# EAGLE design 16*VibrationdriverMod (EAGLE 7.2.0)
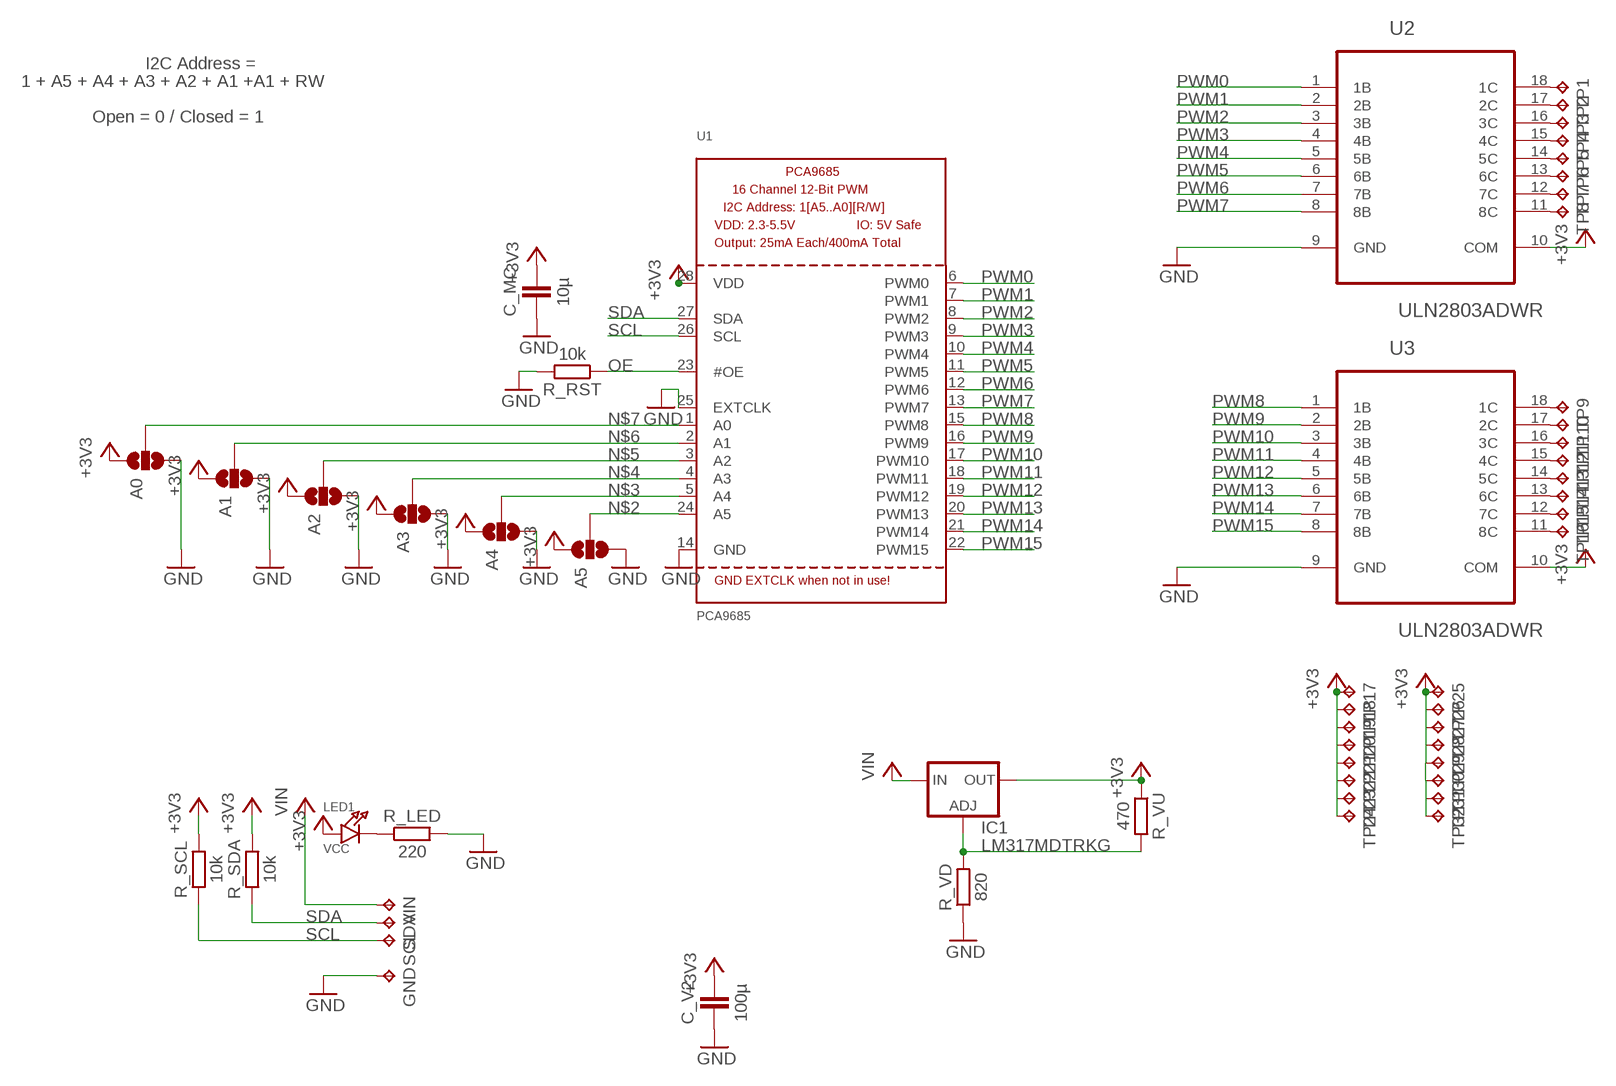
[diagram p0: schematic, sheet 1]

## Parts
A0  SOLDERJUMPER_2WAYPASTE2&3  [SJ_3_PASTE2&3]
A1  SOLDERJUMPER_2WAYPASTE2&3  [SJ_3_PASTE2&3]
A2  SOLDERJUMPER_2WAYPASTE2&3  [SJ_3_PASTE2&3]
A3  SOLDERJUMPER_2WAYPASTE2&3  [SJ_3_PASTE2&3]
A4  SOLDERJUMPER_2WAYPASTE2&3  [SJ_3_PASTE2&3]
A5  SOLDERJUMPER_2WAYPASTE2&3  [SJ_3_PASTE2&3]
C_MC  10µ  CAPACITOR  [603]
C_V2  100µ  CAPACITOR1206  [1206]
GND  TPTP16SQ  [TP16SQ]
IC1  LM317MDTRKG  [DPACK]
LED1  VCC  LED0603  [CHIPLED_0603]
R_LED  220  RESISTOR0603  [603]
R_RST  10k  RESISTOR0603  [603]
R_SCL  10k  RESISTOR0603  [603]
R_SDA  10k  RESISTOR0603  [603]
R_VD  820  RESISTOR0603  [603]
R_VU  470  RESISTOR0603  [603]
SCL  TPTP16SQ  [TP16SQ]
SDA  TPTP16SQ  [TP16SQ]
TP1  TPTP16SQ  [TP16SQ]
TP2  TPTP16SQ  [TP16SQ]
TP3  TPTP16SQ  [TP16SQ]
TP4  TPTP16SQ  [TP16SQ]
TP5  TPTP16SQ  [TP16SQ]
TP6  TPTP16SQ  [TP16SQ]
TP7  TPTP16SQ  [TP16SQ]
TP8  TPTP16SQ  [TP16SQ]
TP9  TPTP16SQ  [TP16SQ]
TP10  TPTP16SQ  [TP16SQ]
TP11  TPTP16SQ  [TP16SQ]
TP12  TPTP16SQ  [TP16SQ]
TP13  TPTP16SQ  [TP16SQ]
TP14  TPTP16SQ  [TP16SQ]
TP15  TPTP16SQ  [TP16SQ]
TP16  TPTP16SQ  [TP16SQ]
TP17  TPTP16SQ  [TP16SQ]
TP18  TPTP16SQ  [TP16SQ]
TP19  TPTP16SQ  [TP16SQ]
TP20  TPTP16SQ  [TP16SQ]
TP21  TPTP16SQ  [TP16SQ]
TP22  TPTP16SQ  [TP16SQ]
TP23  TPTP16SQ  [TP16SQ]
TP24  TPTP16SQ  [TP16SQ]
TP25  TPTP16SQ  [TP16SQ]
TP26  TPTP16SQ  [TP16SQ]
TP27  TPTP16SQ  [TP16SQ]
TP28  TPTP16SQ  [TP16SQ]
TP29  TPTP16SQ  [TP16SQ]
TP30  TPTP16SQ  [TP16SQ]
TP31  TPTP16SQ  [TP16SQ]
TP32  TPTP16SQ  [TP16SQ]
U1  PCA9685  [TSSOP28]
U2  ULN2803ADWR  [SOIC127P1030X265-18N]
U3  ULN2803ADWR  [SOIC127P1030X265-18N]
VIN  TPTP16SQ  [TP16SQ]

## Nets
+3V3: A0.1 A1.1 A2.1 A3.1 A4.1 A5.1 C_MC.2 C_V2.2 IC1.4(OUT) LED1.A R_SCL.2 R_SDA.2 R_VU.1 TP17.TP TP18.TP TP19.TP TP20.TP TP21.TP TP22.TP TP23.TP TP24.TP TP25.TP TP26.TP TP27.TP TP28.TP TP29.TP TP30.TP TP31.TP TP32.TP U1.28(VDD) U2.10(COM) U3.10(COM)
GND: A0.3 A1.3 A2.3 A3.3 A4.3 A5.3 C_MC.1 C_V2.1 GND.TP R_LED.2 R_RST.2 R_VD.1 U1.14(GND) U1.25(EXTCLK) U2.9(GND) U3.9(GND)
N$1: LED1.C R_LED.1
N$2: A5.2 U1.24(A5)
N$3: A4.2 U1.5(A4)
N$4: A3.2 U1.4(A3)
N$5: A2.2 U1.3(A2)
N$6: A1.2 U1.2(A1)
N$7: A0.2 U1.1(A0)
N$14: TP1.TP U2.18(1C)
N$18: IC1.1(ADJ) R_VD.2 R_VU.2
N$19: TP2.TP U2.17(2C)
N$20: TP3.TP U2.16(3C)
N$21: TP4.TP U2.15(4C)
N$22: TP5.TP U2.14(5C)
N$23: TP6.TP U2.13(6C)
N$24: TP7.TP U2.12(7C)
N$25: TP8.TP U2.11(8C)
N$26: TP9.TP U3.18(1C)
N$27: TP10.TP U3.17(2C)
N$28: TP11.TP U3.16(3C)
N$29: TP12.TP U3.15(4C)
N$30: TP13.TP U3.14(5C)
N$31: TP14.TP U3.13(6C)
N$32: TP15.TP U3.12(7C)
N$33: TP16.TP U3.11(8C)
OE: R_RST.1 U1.23(#OE)
PWM0: U1.6(PWM0) U2.1(1B)
PWM1: U1.7(PWM1) U2.2(2B)
PWM2: U1.8(PWM2) U2.3(3B)
PWM3: U1.9(PWM3) U2.4(4B)
PWM4: U1.10(PWM4) U2.5(5B)
PWM5: U1.11(PWM5) U2.6(6B)
PWM6: U1.12(PWM6) U2.7(7B)
PWM7: U1.13(PWM7) U2.8(8B)
PWM8: U1.15(PWM8) U3.1(1B)
PWM9: U1.16(PWM9) U3.2(2B)
PWM10: U1.17(PWM10) U3.3(3B)
PWM11: U1.18(PWM11) U3.4(4B)
PWM12: U1.19(PWM12) U3.5(5B)
PWM13: U1.20(PWM13) U3.6(6B)
PWM14: U1.21(PWM14) U3.7(7B)
PWM15: U1.22(PWM15) U3.8(8B)
SCL: R_SCL.1 SCL.TP U1.26(SCL)
SDA: R_SDA.1 SDA.TP U1.27(SDA)
VCC: IC1.3(IN) VIN.TP ; supply symbol labelled VIN

## Notes on the sheet
- I2C Address =
- 1 + A5 + A4 + A3 + A2 + A1 +A1 + RW
- Open = 0 / Closed = 1

## Library data of the parts
A0 A1-A5 = SparkFun-Retired:SOLDERJUMPER_2WAY: Solder Jumper 2 way solder jumper
C_MC C_V2 = thar:CAPACITOR
GND SCL SDA TP1-TP32 VIN = testpad:TP: Test pad
IC1 = v-reg:LM317?*: 500 mA Adjustable Output Positive Voltage Regulator Source: http://www.onsemi.co.jp .. LM317M-D.PDF
LED1 = microbuilder:LED: LED 0603 - 0603 Surface Mount Package 2mA: Green LED - Low Power (3.9mcd, 2ma, 1.7Vf) - Digikey: 475-2709-2-ND Orange LED - Low Power (9.8mcd, 2ma, 1.8Vf) - Digikey: 475-1194-2-ND Red LED - Low Power (5mcd, 2ma, 1.8Vf) - Digikey: 475-1195-2-ND Yellow LED - Low Power (7mcd, 2ma, 1.8Vf) - Digikey: 475-1196-2-ND 5mA: Blue LED - Low Power (17mcd, 5ma, 2.9Vf) - Digikey: LNJ937W8CRACT-ND 0805 - 0805 Surface Mount Package 2mA: Red LED (8.8mcd, 2mA, 1.8Vf, Clear) - Low Power [Digikey: 475-2510-1-ND] Green LED (5mcd, 2mA, 1.8Vf, Clear) - Low Power [Digikey: 475-2730-1-ND] Yellow LED (11.3mcd, 2mA, 1.8Vf, Clear) - Low Power [Digikey: 475-2555-1-ND] 20mA: Red LED (104mcd, 20mA, Diffused) - LS R976 [Digikey: 475-1278-6-ND] Red LED (12mcd, 20mA, 2.0Vf, Clear) - APT2012EC [Digikey: 754-1128-1-ND] Green LED (15mcd, 20mA, 2.2Vf, Clear) - APT2012GC [Digikey: 754-1131-1-ND] Orange LED (160mcd, 20mA, 2.1Vf, Clear) - APT2012SECK [Digikey: 754-1130-1-ND] 1206 - 1206 Surface Mount Package Green LED (26mcd, 20mA, Diffused) - LG N971 [Digikey: 475-1407-6-ND] Red LED (15mcd, 20mA, Diffused) - LH N974 [Digikey: 475-1416-6-ND]
R_LED R_RST R_SCL R_SDA R_VD R_VU = thar:RESISTOR
U1 = microbuilder:PCA9685: PCA9685 - 16 Channel 12-Bit I2C PWM Controller 5.0V tolerant 16 channel, 12-bit I2C PWM controller with 25mA per output (max. 400mA total) Digikey: 568-5931-1-ND
U2 U3 = TI_ULN2803:ULN2803ADWR: Darlington transistor array; MPN: ULN2803ADWR; OC_FARNELL: 1652420; OC_NEWARK: 87H4769; PACKAGE: SOIC-18; SUPPLIER: TEXAS INSTRUMENTS

## Board
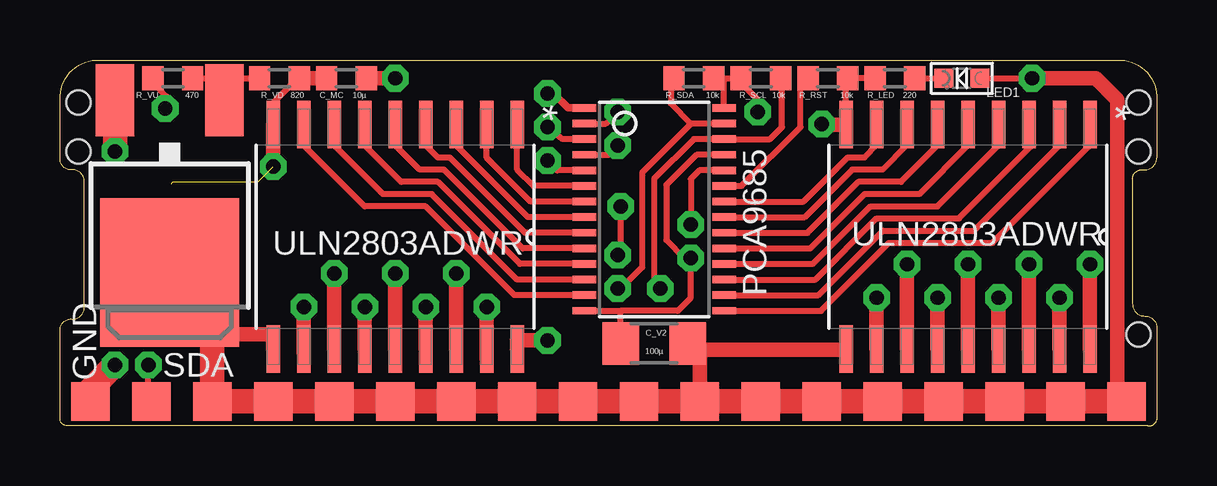
[diagram p1: board, top side]
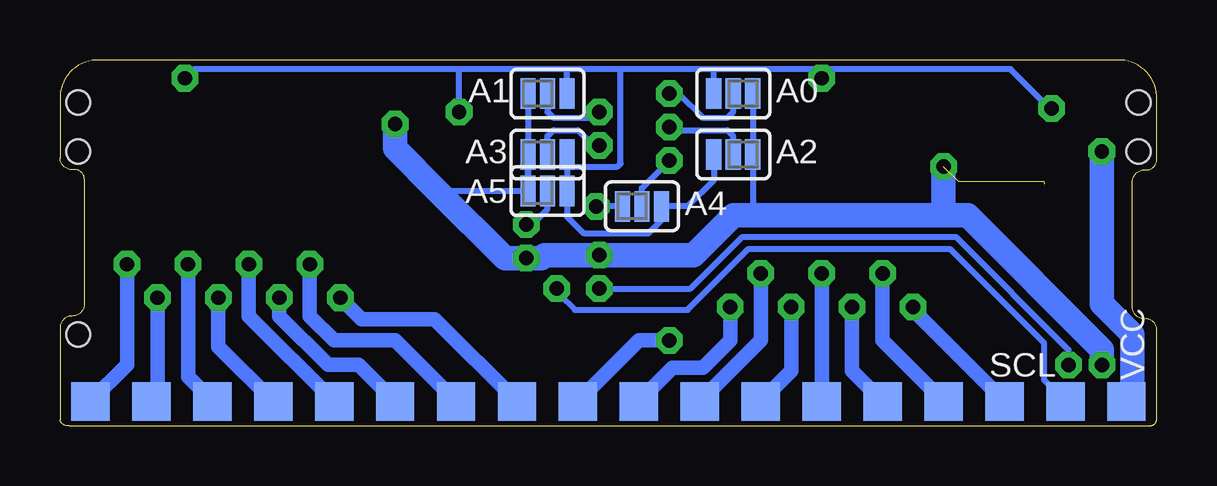
[diagram p2: board, bottom side, seen from below]

Size 45.72 x 15.25 mm. Coordinates in mm from the lower left corner, seen from the top.
Outline: 0.26,0.01 arc-74 0,0.26 0,3.94 arc-106 0.51,4.45 arc90 1.02,4.96 1.02,10.17 arc90 0.51,10.67 arc-106 0,11.18 0,13.6 arc-95 1.66,15.25 44.07,15.25 arc-95 45.72,13.6 45.72,11.18 arc-90 45.22,10.67 45.09,10.67 arc90 44.71,10.29 44.71,5.09 arc90 45.22,4.58 arc-90 45.72,4.07 45.72,0.26 arc-90 45.34,0.01 0.26,0.01
Copper layers (1*16): Top 0.035mm / dielectric 1.5mm / Bottom 0.035mm
Design rules "PCBCart-Standard": minimum track width 8mil, minimum drill 0.4mm, track to track 8mil, track to pad 8mil, pad to pad 8mil, via to via 8mil, smd to smd 8mil, copper to edge 20mil, drill to drill 8mil, minimum pad ring 8mil, minimum via ring 10mil, stop-mask expansion 3mil, vias tented up to drill 20mil, thermal gap 8mil
Holes 1 mm at 0.77,11.44 44.96,11.44 44.96,3.82 44.96,13.47 0.77,13.47

### Footprints (pad centres in the part's own frame; a part is rotated, then mirrored left to right if it is on the bottom)
SJ_3_PASTE2&3 = smd 0.635 x 1.27: 1 -0.813,0; 2 0,0; 3 0.813,0
603 = smd 0.889 x 1.016: 1 -0.826,0; 2 0.826,0
1206 = smd 1.524 x 1.778: 1 -1.397,0; 2 1.397,0
TP16SQ = smd 1.6 x 1.6: TP 0,0
DPACK = smd 1.6 x 3: 1 -2.28,-4.8; 3 2.28,-4.8 | smd 5.8 x 6.2: 4 0,2.38
CHIPLED_0603 = smd 0.8 x 0.8: A 0,-0.75; C 0,0.75
TSSOP28 = smd 0.305 x 0.991: 1 -4.225,-2.918; 2 -3.575,-2.918; 3 -2.925,-2.918; 4 -2.275,-2.918; 5 -1.625,-2.918; 6 -0.975,-2.918; 7 -0.325,-2.918; 8 0.325,-2.918; 9 0.975,-2.918; 10 1.625,-2.918; 11 2.275,-2.918; 12 2.925,-2.918; 13 3.575,-2.918; 14 4.225,-2.918; 15 4.225,2.918; 16 3.575,2.918; 17 2.925,2.918; 18 2.275,2.918; 19 1.625,2.918; 20 0.975,2.918; 21 0.325,2.918; 22 -0.325,2.918; 23 -0.975,2.918; 24 -1.625,2.918; 25 -2.275,2.918; 26 -2.925,2.918; 27 -3.575,2.918; 28 -4.225,2.918
SOIC127P1030X265-18N = smd 1.981 x 0.559: 1 -4.674,5.08; 2 -4.674,3.81; 3 -4.674,2.54; 4 -4.674,1.27; 5 -4.674,0; 6 -4.674,-1.27; 7 -4.674,-2.54; 8 -4.674,-3.81; 9 -4.674,-5.08; 10 4.674,-5.08; 11 4.674,-3.81; 12 4.674,-2.54; 13 4.674,-1.27; 14 4.674,0; 15 4.674,1.27; 16 4.674,2.54; 17 4.674,3.81; 18 4.674,5.08

### Placement (x,y rotation side)
A0  17.66,13.85 0 bottom
A1  25.4,13.85 180 bottom
A2  17.66,11.31 0 bottom
A3  25.4,11.31 180 bottom
A4  21.47,9.15 180 bottom
A5  25.4,9.79 180 bottom
C_MC  11.94,14.48 0 top
C_V2  24.77,3.44 0 top
GND  1.27,1.02 0 top
IC1  4.58,8.77 180 top
LED1  37.6,14.48 90 top
R_LED  34.8,14.48 180 top
R_RST  32.01,14.48 0 top
R_SCL  29.21,14.48 180 top
R_SDA  26.42,14.48 0 top
R_VD  9.15,14.48 180 top
R_VU  4.7,14.48 0 top
SCL  3.81,1.02 0 bottom
SDA  3.81,1.02 0 top
TP1  24.13,1.02 0 bottom
TP2  21.59,1.02 0 bottom
TP3  19.05,1.02 0 bottom
TP4  16.51,1.02 0 bottom
TP5  13.97,1.02 0 bottom
TP6  11.43,1.02 0 bottom
TP7  8.89,1.02 0 bottom
TP8  6.35,1.02 0 bottom
TP9  44.45,1.02 0 bottom
TP10  41.91,1.02 0 bottom
TP11  39.37,1.02 0 bottom
TP12  36.83,1.02 0 bottom
TP13  34.29,1.02 0 bottom
TP14  31.75,1.02 0 bottom
TP15  29.21,1.02 0 bottom
TP16  26.67,1.02 0 bottom
TP17  6.35,1.02 0 top
TP18  8.89,1.02 0 top
TP19  11.43,1.02 0 top
TP20  13.97,1.02 0 top
TP21  16.51,1.02 0 top
TP22  19.05,1.02 0 top
TP23  21.59,1.02 0 top
TP24  24.13,1.02 0 top
TP25  26.67,1.02 0 top
TP26  29.21,1.02 0 top
TP27  31.75,1.02 0 top
TP28  34.29,1.02 0 top
TP29  36.83,1.02 0 top
TP30  39.37,1.02 0 top
TP31  41.91,1.02 0 top
TP32  44.45,1.02 0 top
U1  24.77,9.02 270 top
U2  13.97,7.88 270 top
U3  37.85,7.88 270 top
VIN  1.27,1.02 0 bottom

### Tracks (layer width: path | path; a pad name or v marks a point on that pad's centre or on a via)
+3V3  (via drill 0.6)
  Top 0.254: R_VU.1 3.88,14.29 4.45,13.72 v4.39,13.23 | LED1.A v40.52,14.48 | U1.28 27.69,14.48 | 27.69,14.48 28.2,14.48 | R_SDA.2 27.69,14.48 | 28.2,14.48 29.09,13.6 v29.09,13.09 | 28.2,14.48 R_SCL.2
  Top 0.305: 32.75,3.18 U3.10 | 4.68,5.75 4.83,5.98
  Top 0.61: U2.10 8.89,3.82 4.7,3.82 4.58,3.94 4.47,5.49 | 4.47,5.49 4.32,5.34 | 32.75,3.18 26.17,3.18 | TP25.TP 26.67,2.93 C_V2.2 | 4.47,5.49 4.47,5.54 4.68,5.75 | v40.52,14.48 43.18,14.48 44.07,13.6 44.07,1.02 | C_MC.2 v13.97,14.48
  Top 0.813: C_V2.2 26.17,3.18
  Top 1.016: TP32.TP 44.07,1.02 TP31.TP TP30.TP TP29.TP TP28.TP TP27.TP TP26.TP TP25.TP TP24.TP TP23.TP TP22.TP TP21.TP TP20.TP TP19.TP TP18.TP TP17.TP 6.35,3.94 4.83,5.98
  Top 1.27: IC1.4 4.16,4.74 4.07,5.59 4.07,4.32 4.32,4.58
  Top 1.422: 4.32,4.58 4.32,5.34
  Bottom 0.254: A1.1 24.59,14.87 | 24.59,10.12 24.52,10.17 | v4.39,13.23 4.46,13.23 6.1,14.87 13.97,14.87 | 13.97,14.87 18.55,14.87 | 18.55,14.87 22.36,14.87 | 22.36,14.87 24.59,14.87 | 24.59,14.87 29.09,14.87 | 29.09,14.87 40.14,14.87 v40.52,14.48 | v13.97,14.48 13.97,14.87 | v29.09,13.09 29.09,14.87 | A3.1 24.59,10.8 | 24.59,10.8 24.59,10.12 | 24.59,10.12 A5.1 24.59,8.72 23.88,8.01 21.21,8.01 20.65,8.57 A4.1 19.56,9.15 18.47,10.24 A2.1 | A0.1 18.47,14.79 18.55,14.87 | 24.59,10.8 22.48,10.8 22.36,10.93 22.36,14.87
GND  (via drill 0.6)  (3 unrouted)
  Top 0.254: R_VD.1 9.85,14.42 8.89,13.47 U2.9 | U1.25 26.54,11.3 25.28,10.04 25.28,7.75 26.04,6.99 v26.29,6.99 26.29,5.34 25.75,4.8 23.37,4.8 | R_LED.2 R_RST.2 32.77,14.48 U3.9 | C_V2.1 23.37,4.8 | U1.14 23.37,4.8 | v23.37,9.15 23.37,7.5 v23.25,7.12
  Top 0.305: 8.89,12.58 U2.9 | 8.89,10.55 v8.89,10.8
  Top 0.61: U2.9 v8.89,10.8 | U3.9 31.78,12.55 v31.75,12.58 | R_VD.1 C_MC.1
  Top 1.016: v2.29,2.55 1.27,1.53 GND.TP
  Bottom 0.254: A5.3 A3.3 | A0.3 A2.3 16.84,8.77 17.02,8.77 | A1.3 A5.3 | A5.3 29.98,9.79 | 22.28,7.04 23.5,7.12 | A4.3 v23.37,9.15
  Bottom 1.016: v2.29,2.55 2.29,3.18 7.88,8.77 8.89,8.77 | v8.89,10.8 8.89,8.77 | v31.75,12.58 31.75,11.56 29.98,9.79 27.18,6.99 v26.29,6.99 25.66,6.99 25.53,7.12 23.5,7.12 v23.25,7.12 19.31,7.12 17.66,8.77 17.02,8.77 8.89,8.77
N$1
  Top 0.254: R_LED.1 LED1.C
N$2  (via drill 0.6)
  Top 0.254: U1.24 26.65,10.65 26.29,10.29 v26.29,8.39
  Bottom 0.254: v26.29,8.39 26.04,8.39 25.4,9.02 A5.2
N$3  (via drill 0.6)
  Top 0.254: U1.5 20.73,10.65 v20.32,11.06
  Bottom 0.254: A4.2 21.47,9.91 v20.32,11.06
N$4  (via drill 0.6)
  Top 0.254: U1.4 22.85,11.3 v23.25,11.69
  Bottom 0.254: A3.2 25.4,12.07 25.15,12.33 24.13,12.33 23.5,11.69 v23.25,11.69
N$5  (via drill 0.6)
  Top 0.254: U1.3 20.96,11.95 v20.32,12.45
  Bottom 0.254: v20.32,12.45 20.2,12.33 17.91,12.33 17.66,12.07 A2.2
N$6  (via drill 0.6)
  Top 0.254: U1.2 22.76,12.6 v23.25,13.09
  Bottom 0.254: A1.2 25.4,13.09 25.15,12.83 23.5,12.83 v23.25,13.09
N$7  (via drill 0.6)
  Top 0.305: U1.1 21.18,13.25 20.58,13.85 v20.32,13.85
  Bottom 0.254: v20.32,13.85 19.94,13.85 18.93,12.83 17.91,12.83 17.66,13.09 A0.2
N$14  (via drill 0.6)
  Top 0.61: v20.32,3.56 19.05,3.56 U2.18
  Bottom 0.61: v20.32,3.56 21.59,3.56 TP1.TP
N$18
  Top 0.254: R_VD.2 R_VU.2 6.61,14.42 6.61,13.09 6.5,12.81 7.24,12.81
  Top 0.305: IC1.1 7.12,12.81 7.24,12.81 6.74,12.69
N$19  (via drill 0.6)
  Top 0.61: v17.78,4.96 U2.17 17.78,2.8
  Bottom 0.61: v17.78,4.96 17.78,3.56 18.93,2.42 20.2,2.42 TP2.TP
N$20  (via drill 0.6)
  Top 0.61: v16.51,6.36 U2.16
  Bottom 0.61: v16.51,6.36 16.51,3.56 TP3.TP
N$21  (via drill 0.6)
  Top 0.61: v15.24,4.96 U2.15
  Bottom 0.61: v15.24,4.96 15.24,2.29 TP4.TP
N$22  (via drill 0.6)
  Top 0.61: U2.14 v13.97,6.36
  Bottom 0.61: v13.97,6.36 TP5.TP
N$23  (via drill 0.6)
  Top 0.61: v12.7,4.96 U2.13
  Bottom 0.61: v12.7,4.96 12.7,2.29 TP6.TP
N$24  (via drill 0.6)
  Top 0.61: v11.43,6.36 U2.12
  Bottom 0.61: v11.43,6.36 11.43,3.56 TP7.TP
N$25  (via drill 0.6)
  Top 0.61: v10.16,4.96 U2.11 10.16,3.05
  Bottom 0.61: v10.16,4.96 10.16,4.83 TP8.TP
N$26  (via drill 0.6)
  Top 0.61: U3.18 v42.93,6.74
  Bottom 0.61: v42.93,6.74 42.93,2.55 TP9.TP
N$27  (via drill 0.6)
  Top 0.61: U3.17 v41.66,5.34
  Bottom 0.61: v41.66,5.34 41.66,1.28 TP10.TP
N$28  (via drill 0.6)
  Top 0.61: U3.16 v40.39,6.74
  Bottom 0.61: v40.39,6.74 40.39,2.04 TP11.TP
N$29  (via drill 0.6)
  Top 0.61: U3.15 v39.12,5.34
  Bottom 0.61: v39.12,5.34 39.12,3.31 TP12.TP
N$30  (via drill 0.6)
  Top 0.61: U3.14 v37.85,6.74
  Bottom 0.61: v37.85,6.74 37.85,4.58 TP13.TP
N$31  (via drill 0.6)
  Top 0.61: U3.13 v36.58,5.34
  Bottom 0.61: v36.58,5.34 36.58,4.58 34.55,2.55 33.28,2.55 TP14.TP
N$32  (via drill 0.6)
  Top 0.61: U3.12 v35.31,6.74
  Bottom 0.61: v35.31,6.74 35.31,4.58 34.29,3.56 31.75,3.56 TP15.TP
N$33  (via drill 0.6)
  Top 0.61: U3.11 v34.04,5.34
  Bottom 0.61: v34.04,5.34 33.15,4.45 30.1,4.45 TP16.TP
OE
  Top 0.254: U1.23 28.41,10 30.87,12.45 30.87,14.29 R_RST.1
PWM0
  Top 0.254: U1.6 19.73,10 19.05,10.67 U2.1
PWM1
  Top 0.254: U1.7 19.62,9.35 17.78,11.18 U2.2
PWM2
  Top 0.254: U1.8 19.51,8.7 16.51,11.69 U2.3
PWM3
  Top 0.254: U1.9 19.39,8.05 16.26,11.18 15.75,11.18 15.24,11.69 U2.4
PWM4
  Top 0.254: U1.10 19.28,7.4 16.01,10.67 14.99,10.67 13.97,11.69 U2.5
PWM5
  Top 0.254: U1.11 19.17,6.75 15.75,10.17 14.23,10.17 12.7,11.69 U2.6
PWM6
  Top 0.254: U1.12 19.06,6.1 15.5,9.66 13.47,9.66 11.43,11.69 U2.7
PWM7
  Top 0.254: U1.13 18.95,5.45 15.24,9.15 12.7,9.15 10.16,11.69 U2.8
PWM8
  Top 0.254: U1.15 31.72,4.8 34.55,7.63 38.87,7.63 42.93,11.69
  Top 0.305: 42.93,11.69 U3.1
PWM9
  Top 0.254: U1.16 31.61,5.45 34.29,8.13 38.1,8.13 41.66,11.69
  Top 0.305: 41.66,11.69 U3.2
PWM10
  Top 0.254: U1.17 31.5,6.1 34.04,8.64 37.47,8.64 40.52,11.69
  Top 0.305: 40.52,11.69 U3.3
PWM11
  Top 0.254: U1.18 31.38,6.75 33.79,9.15 36.58,9.15 39.12,11.69
  Top 0.305: 39.12,11.69 U3.4
PWM12
  Top 0.254: U3.5 37.85,11.69 35.82,9.66 33.53,9.66 31.27,7.4 U1.19
PWM13
  Top 0.254: U1.20 31.16,8.05 33.28,10.17 35.06,10.17 36.58,11.69 U3.6
PWM14
  Top 0.254: U1.21 31.05,8.7 33.02,10.67 34.29,10.67 35.31,11.69 U3.7
PWM15
  Top 0.254: U1.22 30.99,9.35 32.83,11.18 33.53,11.18 34.04,11.69 U3.8
SCL  (via drill 0.6)
  Top 0.254: R_SCL.1 30.1,14.55 30.1,12.45 29.6,11.95 U1.26 26.42,11.95 24.77,10.29 24.77,5.72 v25.02,5.72
  Bottom 0.254: v25.02,5.72 24.9,5.47 24.26,4.83 19.56,4.83 17.02,7.37 8.64,7.37 4.7,3.44 4.7,1.91 SCL.TP
SDA  (via drill 0.6)
  Top 0.254: U1.27 26.31,12.6 | 26.31,12.6 24.26,10.55 24.26,6.61 23.25,5.59 v23.25,5.72 | R_SDA.1 25.47,14.42 25.47,13.44 26.31,12.6 | SDA.TP 3.69,1.02 v3.69,2.55
  Bottom 0.254: v3.69,2.55 3.69,3.18 8.39,7.88 17.28,7.88 19.44,5.72 v23.25,5.72
VCC  (via drill 0.6)
  Top 1.016: v2.3,11.44 IC1.3
  Bottom 1.016: VIN.TP 1.15,1.02 1.02,1.15 1.02,3.82 2.29,5.09 v2.3,11.44

### Text on the board
tPlace: SDA | GND
bPlace: A0 | A1 | A2 | A3 | A5 | A4 | SCL | VCC